# EAGLE design 9xVoice MikeB TH v1_0a (EAGLE 6.4)
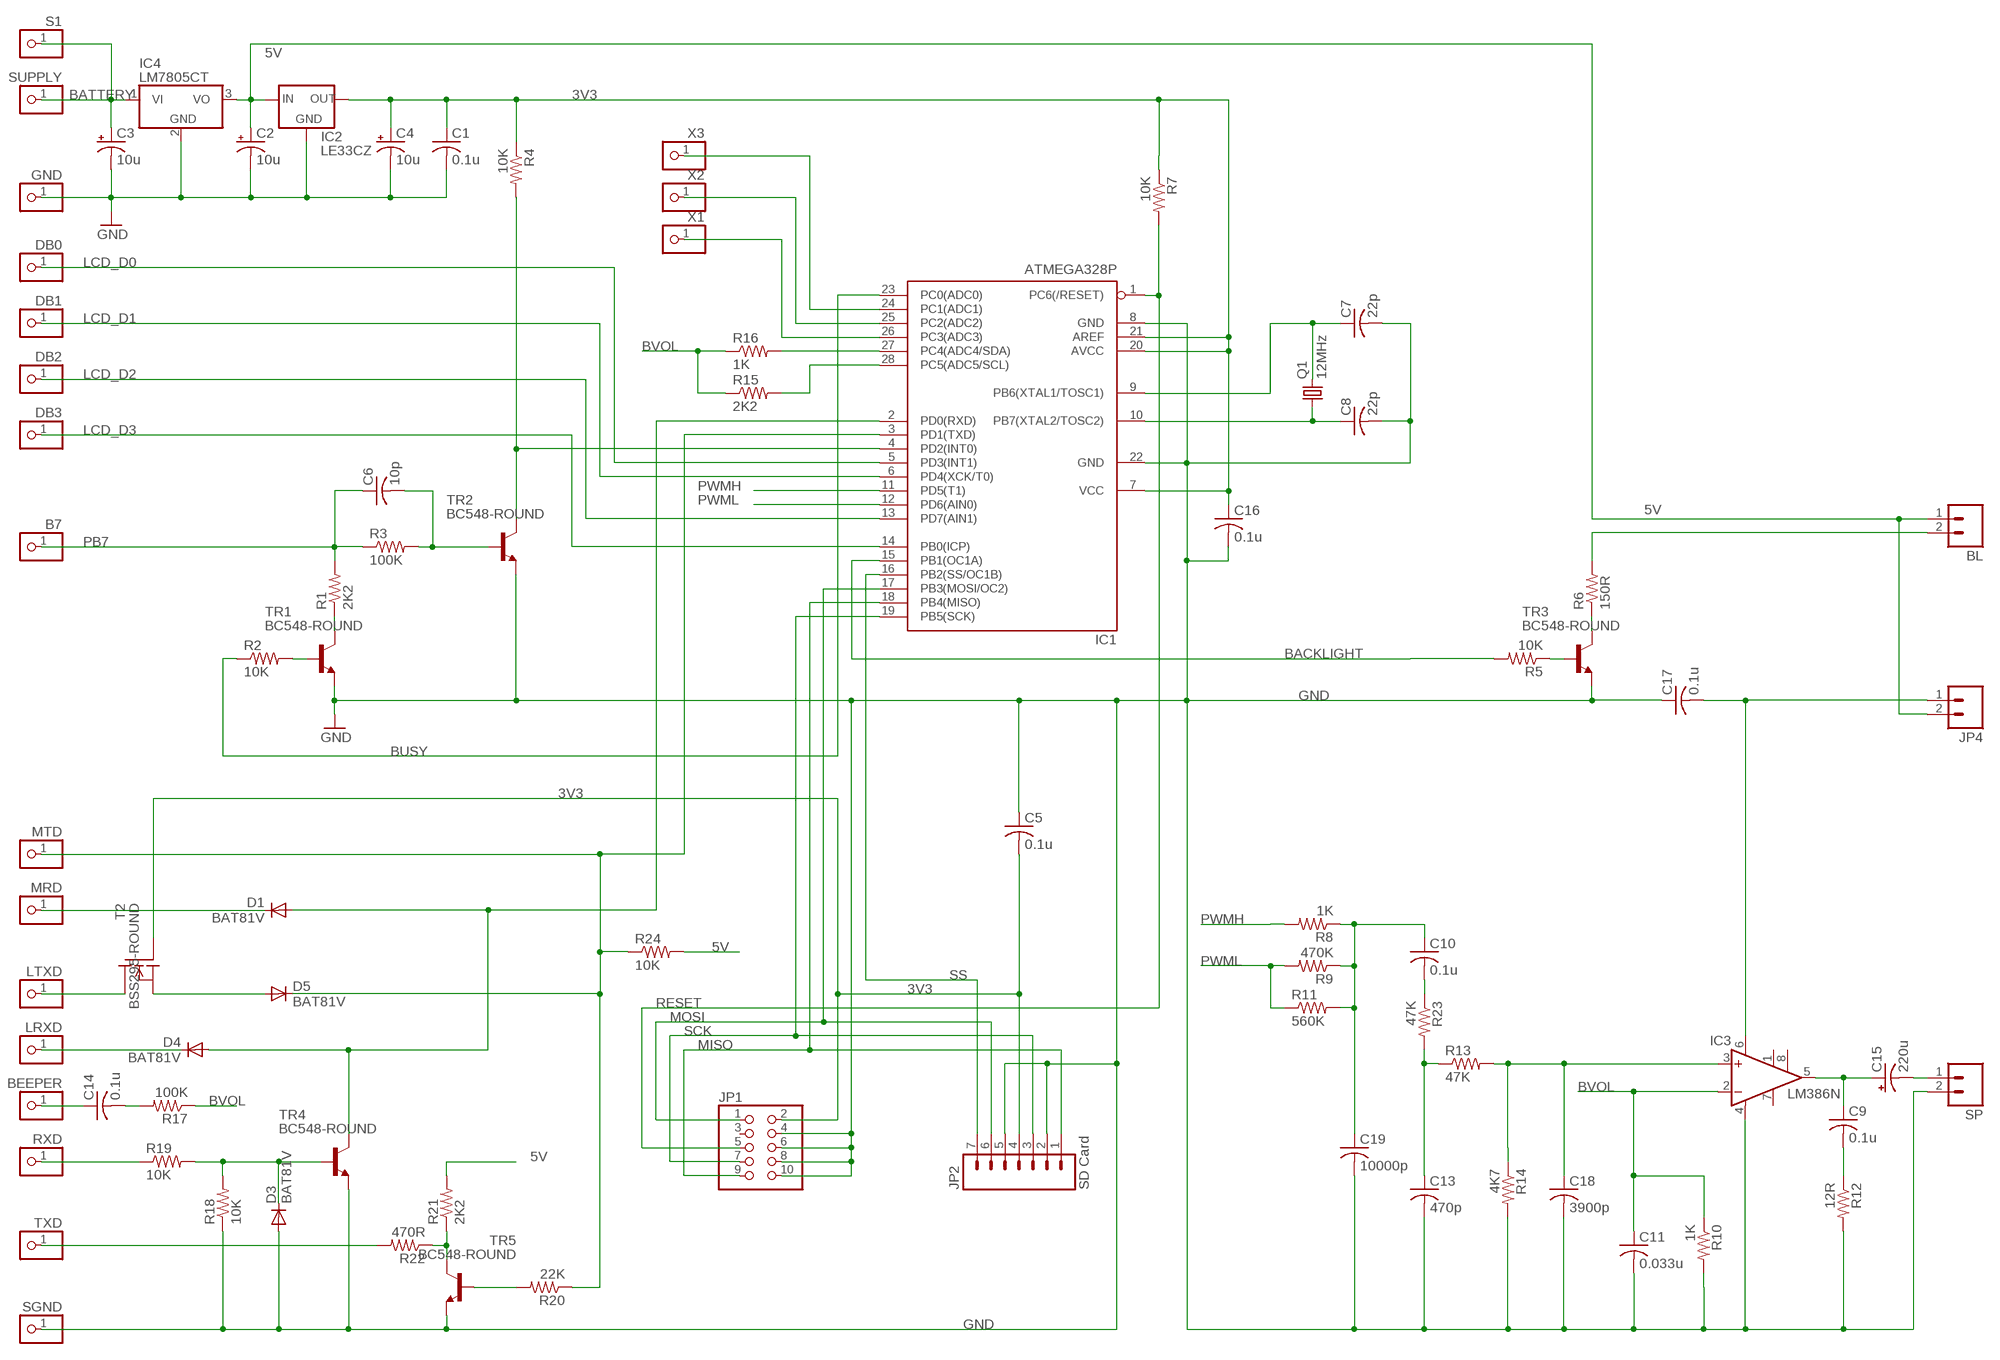
[diagram p0: schematic, sheet 1]

## Parts
B7  PINHD-1X1  [1X01]
BEEPER  PINHD-1X1  [1X01]
BL  M02PTH  [1X02]
C1  0.1u  C-US025-024X044  [C025-024X044]
C2  10u  CPOL-USE2.5-5  [E2,5-5]
C3  10u  CPOL-USE2.5-5  [E2,5-5]
C4  10u  CPOL-USE2.5-5  [E2,5-5]
C5  0.1u  C-US025-024X044  [C025-024X044]
C6  10p  C-US025-024X044  [C025-024X044]
C7  22p  C-US025-024X044  [C025-024X044]
C8  22p  C-US025-024X044  [C025-024X044]
C9  0.1u  C-US025-024X044  [C025-024X044]
C10  0.1u  C-US025-024X044  [C025-024X044]
C11  0.033u  C-US025-024X044  [C025-024X044]
C13  470p  C-US025-024X044  [C025-024X044]
C14  0.1u  C-US025-024X044  [C025-024X044]
C15  220u  CPOL-USE5-8.5  [E5-8,5]
C16  0.1u  C-US025-024X044  [C025-024X044]
C17  0.1u  C-US025-024X044  [C025-024X044]
C18  3900p  C-US025-024X044  [C025-024X044]
C19  10000p  C-US025-024X044  [C025-024X044]
D1  BAT81V  DIODE-D-2.5  [D-2.5]
D3  BAT81V  DIODE-D-2.5  [D-2.5]
D4  BAT81V  DIODE-D-2.5  [D-2.5]
D5  BAT81V  DIODE-D-2.5  [D-2.5]
DB0  PINHD-1X1  [1X01]
DB1  PINHD-1X1  [1X01]
DB2  PINHD-1X1  [1X01]
DB3  PINHD-1X1  [1X01]
GND  PINHD-1X1  [1X01]
IC1  ATMEGA328P  MEGA8-P-JDCJDC  [DIL28-3-JDC]
IC2  LE33CZ  78LXX-ROUND  [TO92-JDC]
IC3  LM386N  LM386N-1  [DIL08]
IC4  LM7805CT  7805T  [TO220H]
JP1  PINHD-2X5  [2X05]
JP2  SD Card  M07  [1X07]
JP4  M02PTH  [1X02]
LRXD  PINHD-1X1  [1X01]
LTXD  PINHD-1X1  [1X01]
MRD  PINHD-1X1  [1X01]
MTD  PINHD-1X1  [1X01]
Q1  12MHz  CRYSTALHC49US  [HC49US]
R1  2K2  R-US_0207/2V  [0207/2V]
R2  10K  R-US_0204/7  [0204/7]
R3  100K  R-US_0207/2V  [0207/2V]
R4  10K  R-US_0207/2V  [0207/2V]
R5  10K  R-US_0207/2V  [0207/2V]
R6  150R  R-US_0207/2V  [0207/2V]
R7  10K  R-US_0207/2V  [0207/2V]
R8  1K  R-US_0207/2V  [0207/2V]
R9  470K  R-US_0207/2V  [0207/2V]
R10  1K  R-US_0207/2V  [0207/2V]
R11  560K  R-US_0207/2V  [0207/2V]
R12  12R  R-US_0207/2V  [0207/2V]
R13  47K  R-US_0207/2V  [0207/2V]
R14  4K7  R-US_0207/2V  [0207/2V]
R15  2K2  R-US_0207/2V  [0207/2V]
R16  1K  R-US_0207/2V  [0207/2V]
R17  100K  R-US_0207/2V  [0207/2V]
R18  10K  R-US_0207/2V  [0207/2V]
R19  10K  R-US_0207/2V  [0207/2V]
R20  22K  R-US_0207/2V  [0207/2V]
R21  2K2  R-US_0207/2V  [0207/2V]
R22  470R  R-US_0207/2V  [0207/2V]
R23  47K  R-US_0207/2V  [0207/2V]
R24  10K  R-US_0207/2V  [0207/2V]
RXD  PINHD-1X1  [1X01]
S1  PINHD-1X1  [1X01]
SGND  PINHD-1X1  [1X01]
SP  M02PTH  [1X02]
SUPPLY  PINHD-1X1  [1X01]
T2  BSS295-ROUND  [TO92-JDC]
TR1  BC548-ROUND  [TO92-JDC]
TR2  BC548-ROUND  [TO92-JDC]
TR3  BC548-ROUND  [TO92-JDC]
TR4  BC548-ROUND  [TO92-JDC]
TR5  BC548-ROUND  [TO92-JDC]
TXD  PINHD-1X1  [1X01]
X1  PINHD-1X1  [1X01]
X2  PINHD-1X1  [1X01]
X3  PINHD-1X1  [1X01]

## Nets
3V3: C1.1 C4.+ C5.2 C16.1 IC1.7(VCC) IC1.20(AVCC) IC1.21(AREF) IC2.C(OUT) JP1.2 JP2.4 R4.1 R7.1 T2.B(G)
5V: BL.1 C2.+ IC2.E(IN) IC4.3(VO) JP4.2 R21.2 R24.2
BACKLIGHT: IC1.15(PB1(OC1A)) R5.2
BATTERY: C3.+ IC4.1(VI) S1.1 SUPPLY.1
BUSY: IC1.23(PC0(ADC0)) R2.1
BVOL: C11.1 IC3.2(-IN) R10.1 R15.1 R16.1 R17.1
GND: C1.2 C2.- C3.- C4.- C5.1 C7.2 C8.2 C11.2 C13.2 C16.2 C17.1 C18.2 C19.2 D3.A GND.1 IC1.8(GND) IC1.22(GND) IC2.B(GND) IC3.4(GND) IC4.2(GND) JP1.4 JP1.6 JP1.8 JP1.10 JP2.2 JP2.5 R10.2 R12.2 R14.2 R18.1 SGND.1 SP.2 TR1.E TR2.E TR3.E TR4.E TR5.E
LCD_D0: DB0.1 IC1.5(PD3(INT1))
LCD_D1: DB1.1 IC1.6(PD4(XCK/T0))
LCD_D2: DB2.1 IC1.13(PD7(AIN1))
LCD_D3: DB3.1 IC1.14(PB0(ICP))
MISO: IC1.18(PB4(MISO)) JP1.9 JP2.1
MOSI: IC1.17(PB3(MOSI/OC2)) JP1.1 JP2.6
N$1: C13.1 R13.1 R23.2
N$2: R21.1 R22.1 TR5.C
N$3: R22.2 TXD.1
N$4: R20.2 TR5.B
N$5: IC1.28(PC5(ADC5/SCL)) R15.2
N$6: IC1.27(PC4(ADC4/SDA)) R16.2
N$7: IC1.26(PC3(ADC3)) X1.1
N$8: IC1.25(PC2(ADC2)) X2.1
N$9: IC1.24(PC1(ADC1)) X3.1
N$10: R19.1 RXD.1
N$11: D3.C R18.2 R19.2 TR4.B
N$12: D4.C LRXD.1
N$14: D5.A T2.C(S)
N$17: LTXD.1 T2.E(D)
N$18: D1.C MRD.1
N$21: R1.1 TR1.C
N$22: R2.2 TR1.B
N$23: C6.2 R3.2 TR2.B
N$24: BEEPER.1 C14.1
N$25: C14.2 R17.2
N$26: R5.1 TR3.B
N$27: R6.1 TR3.C
N$28: C10.2 R23.1
N$29: IC1.4(PD2(INT0)) R4.2 TR2.C
N$30: C8.1 IC1.10(PB7(XTAL2/TOSC2)) Q1.1
N$31: C7.1 IC1.9(PB6(XTAL1/TOSC1)) Q1.2
N$33: BL.2 R6.2
N$34: C9.1 C15.+ IC3.5(OUT)
N$35: C9.2 R12.1
N$36: C15.- SP.1
N$37: C17.2 IC3.6(VS) JP4.1
N$39: C10.1 C19.1 R8.1 R9.1 R11.2
N$40: C18.1 IC3.3(+IN) R13.2 R14.1
PB7: B7.1 C6.1 R1.2 R3.1
PWMH: IC1.11(PD5(T1)) R8.2
PWML: IC1.12(PD6(AIN0)) R9.2 R11.1
RESET: IC1.1(PC6(/RESET)) JP1.5 R7.2
RXD: D1.A D4.A IC1.2(PD0(RXD)) TR4.C
SCK: IC1.19(PB5(SCK)) JP1.7 JP2.3
SS: IC1.16(PB2(SS/OC1B)) JP2.7
TXD: D5.C IC1.3(PD1(TXD)) MTD.1 R20.1 R24.1
Unconnected: IC3.1(GAIN) IC3.7(BYPASS) IC3.8(GAIN) JP1.3

## Library data of the parts
B7 BEEPER DB0 DB1-DB3 GND LRXD LTXD MRD MTD RXD S1 SGND SUPPLY TXD X1-X3 = pinhead:PINHD-1X1: PIN HEADER
BL JP4 SP = SparkFun-Connectors:M02: Header 2 Standard 2-pin 0.1" header. Use with straight break away headers (SKU : PRT-00116), right angle break away headers (PRT-00553), swiss pins (PRT-00743), machine pins (PRT-00117), and female headers (PRT-00115). Molex polarized connector foot print use with SKU : PRT-08233 with associated crimp pins and housings.
C1 C5-C11 C13 C14 C16-C19 = rcl:C-US: CAPACITOR, American symbol
C2-C4 C15 = rcl:CPOL-US: POLARIZED CAPACITOR, American symbol
D1 D3-D5 = diode:DIODE-: DIODE
IC1 = jdc:MEGA8-P-JDC: MICROCONTROLLER 8 Kbytes FLASH, 1 kbytes SRAM, 512 bytes EEPROM, USART, 4-channel 10 bit ADC, 2-channel 8 bit ADC Pin compatible with Atmega48, ATMega88, ATMega168 Source: avr.lbr
IC2 = jdc:78LXX: VOLTAGE REGULATOR
IC3 = linear:LM386?-*: Low Voltage Audio Power Amplifier Source: http://cache.national.com/ds/LM/LM386.pdf
IC4 = linear:78*: Positive VOLTAGE REGULATOR Source: http://cache.national.com/ds/LM/LM78L05.pdf http://www.fairchildsemi.com/ds/LM/LM7805.pdf
JP1 = pinhead:PINHD-2X5: PIN HEADER
JP2 = SparkFun-Connectors:M07: Header 7 Standard 7-pin 0.1" header. Use with straight break away headers (SKU : PRT-00116), right angle break away headers (PRT-00553), swiss pins (PRT-00743), machine pins (PRT-00117), and female headers (PRT-00115). NOTES ON THE VARIANTS LOCK and LOCK_LONGPADS... This footprint was designed to help hold the alignment of a through-hole component (i.e. 7-pin header) while soldering it into place. You may notice that each hole has been shifted either up or down by 0.005 of an inch from it's more standard position (which is usually a perfectly straight line). This slight alteration caused the pins (the squares in the middle) to touch the edges of the holes. Because they are alternating, it causes a "brace" to hold the header in place. 0.005 has proven to be the perfect amount of "off-center" position when using our standard breakaway headers. Although looks a little odd when you look at the bare footprint, once you have a header in there, the alteration is very hard to notice. Also, if you push a header all the way into place, it is covered up entirely on the bottom side. This idea of altering the position of holes to aid alignment will be further integrated into the Sparkfun Library for other footprints. It can help hold any component with 3 or more connection pins.
Q1 = SparkFun-FreqCtrl:CRYSTAL: Various standard crystals. Proven footprints. Spark Fun Electronics SKU : COM-00534
R1-R24 = rcl:R-US_: RESISTOR, American symbol
T2 = jdc:BSS295: N-Channel Enhancement MOSFET not checked
TR1-TR5 = jdc:BC548*: NPN Transistor

## Board
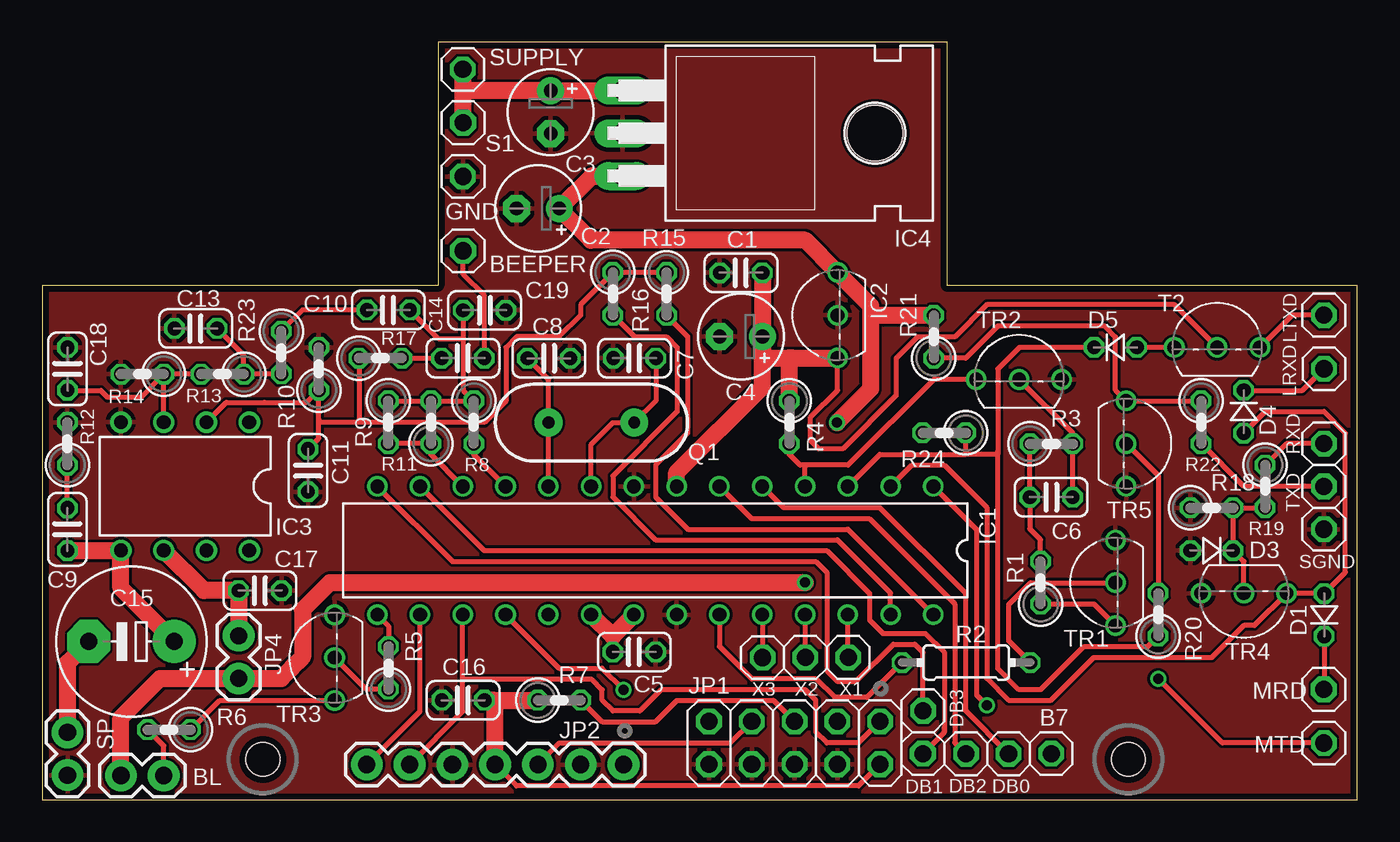
[diagram p1: board, top side]
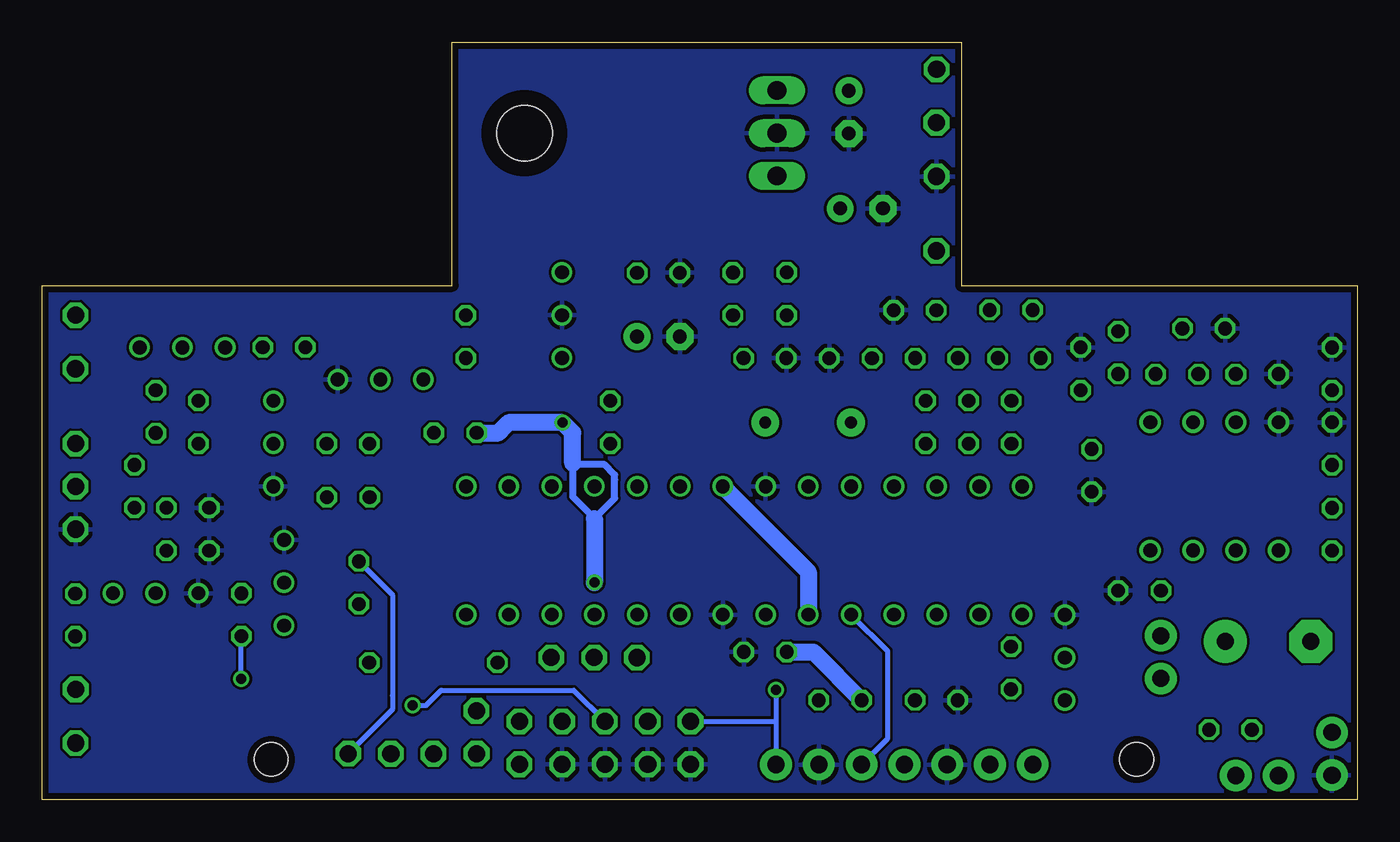
[diagram p2: board, bottom side, seen from below]

Size 78.1 x 45 mm. Coordinates in mm from the lower left corner, seen from the top.
Outline: 0,0 78.1,0 78.1,30.55 53.75,30.55 53.75,45 23.5,45 23.5,30.55 0,30.55 0,0
Copper layers (1*16): Top 0.0356mm / dielectric 1.5011mm / Bottom 0.0356mm
Design rules "LaenPCBOrder *": minimum track width 6mil, minimum drill 13mil, track to track 6mil, track to pad 6mil, pad to pad 6mil, via to via 6mil, smd to smd 6mil, copper to edge 15mil, drill to drill 6mil, minimum pad ring 7mil, minimum via ring 7mil, stop-mask expansion 4mil, vias tented up to drill 24mil, thermal gap 10mil
Holes 2 mm at 13.1,2.4 64.5,2.4

### Footprints (pad centres in the part's own frame; a part is rotated, then mirrored left to right if it is on the bottom)
1X01 = drill 1.016 octagon: 1 0,0
1X02 = drill 1.016 pad 1.88: 1 0,0; 2 2.54,0
C025-024X044 = drill 0.813 octagon: 1 -1.27,0; 2 1.27,0
E2,5-5 = drill 0.813 pad 1.6: + -1.27,0 | drill 0.813 pad 1.6 octagon: - 1.27,0
E5-8,5 = drill 1.016 pad 2.54: + -2.54,0 | drill 1.016 pad 2.54 octagon: - 2.54,0
D-2.5 = drill 0.813 octagon: A 1.27,0; C -1.27,0
DIL28-3-JDC = drill 0.813: 1 -16.51,-3.81; 2 -13.97,-3.81; 3 -11.43,-3.81; 4 -8.89,-3.81; 5 -6.35,-3.81; 6 -3.81,-3.81; 7 -1.27,-3.81; 8 1.27,-3.81; 9 3.81,-3.81; 10 6.35,-3.81; 11 8.89,-3.81; 12 11.43,-3.81; 13 13.97,-3.81; 14 16.51,-3.81; 15 16.51,3.81; 16 13.97,3.81; 17 11.43,3.81; 18 8.89,3.81; 19 6.35,3.81; 20 3.81,3.81; 21 1.27,3.81; 22 -1.27,3.81; 23 -3.81,3.81; 24 -6.35,3.81; 25 -8.89,3.81; 26 -11.43,3.81; 27 -13.97,3.81; 28 -16.51,3.81
TO92-JDC = drill 0.813: B 0,0; C -2.54,0; E 2.54,0
DIL08 = drill 0.813 pad 1.27: 1 -3.81,-3.81; 2 -1.27,-3.81; 3 1.27,-3.81; 4 3.81,-3.81; 5 3.81,3.81; 6 1.27,3.81; 7 -1.27,3.81; 8 -3.81,3.81
TO220H = drill 1.118 long: 1 -2.54,-10.16; 2 0,-10.16; 3 2.54,-10.16 | hole 3.302: 0,4.826
2X05 = drill 1.016 octagon: 1 -5.08,-1.27; 2 -5.08,1.27; 3 -2.54,-1.27; 4 -2.54,1.27; 5 0,-1.27; 6 0,1.27; 7 2.54,-1.27; 8 2.54,1.27; 9 5.08,-1.27; 10 5.08,1.27
1X07 = drill 1.016 pad 1.88: 1 0,0; 2 2.54,0; 3 5.08,0; 4 7.62,0; 5 10.16,0; 6 12.7,0; 7 15.24,0
HC49US = drill 0.7 pad 1.651: 1 -2.54,0; 2 2.54,0
0207/2V = drill 0.813 octagon: 1 -1.27,0; 2 1.27,0
0204/7 = drill 0.813 octagon: 1 -3.81,0; 2 3.81,0

### Placement (x,y rotation side)
B7  59.92,2.74 0 top
BEEPER  25,32.6 0 top
BL  4.68,1.44 0 top
C1  41.5,31.3 180 top
C2  29.44,35.12 180 top
C3  30.2,40.84 270 top
C4  41.5,27.51 180 top
C5  35.16,8.78 180 top
C6  59.92,17.97 0 top
C7  35.18,26.23 180 top
C8  30.09,26.22 0 top
C9  1.5,16.06 90 top
C10  20.56,29.09 180 top
C11  15.79,19.56 270 top
C13  9.12,27.99 180 top
C14  24.99,26.23 180 top
C15  5.31,9.4 180 top
C16  25,5.91 180 top
C17  12.94,12.42 180 top
C18  1.51,25.59 90 top
C19  26.27,29.07 0 top
D1  76.13,10.98 90 top
D3  69.45,14.8 180 top
D4  71.35,23.05 270 top
D5  63.73,26.87 0 top
DB0  57.39,2.73 0 top
DB1  54.86,2.73 0 top
DB2  52.3,2.74 0 top
DB3  52.31,5.28 0 top
GND  24.99,37.02 0 top
IC1  36.41,14.8 180 top
IC2  47.23,28.78 90 top
IC3  8.49,18.62 180 top
IC4  44.63,39.59 270 top
JP1  44.68,3.38 180 top
JP2  34.52,2.09 180 top
JP4  11.67,9.74 270 top
LRXD  76.12,25.6 0 top
LTXD  76.11,28.78 0 top
MRD  76.1,6.56 0 top
MTD  76.11,3.37 0 top
Q1  32.62,22.4 0 top
R1  59.29,12.89 90 top
R2  54.87,8.15 0 top
R3  59.93,21.14 0 top
R4  44.37,22.42 270 top
R5  20.57,7.83 90 top
R6  7.54,4.16 180 top
R7  30.71,5.91 0 top
R8  25.63,22.42 270 top
R9  20.55,22.42 270 top
R10  16.43,25.6 90 top
R11  23.09,22.42 90 top
R12  1.5,21.15 90 top
R13  10.71,25.28 180 top
R14  5.95,25.28 180 top
R15  37.08,30.04 270 top
R16  33.89,30.05 270 top
R17  20.08,26.23 0 top
R18  69.45,17.34 0 top
R19  72.62,18.61 270 top
R20  66.27,10.99 90 top
R21  52.94,27.5 90 top
R22  68.82,22.42 270 top
R23  14.2,26.56 270 top
R24  53.57,21.79 180 top
RXD  76.11,21.15 0 top
S1  25,40.21 0 top
SGND  76.11,16.07 0 top
SP  1.51,4 270 top
SUPPLY  24.98,43.38 0 top
T2  69.77,26.86 0 top
TR1  63.73,12.89 90 top
TR2  58.01,24.96 0 top
TR3  17.37,8.44 90 top
TR4  71.36,12.27 180 top
TR5  64.37,21.15 270 top
TXD  76.11,18.61 0 top
X1  47.87,8.45 0 top
X2  45.32,8.45 0 top
X3  42.78,8.44 0 top

### Tracks (layer width: path | path; a pad name or v marks a point on that pad's centre or on a via)
3V3
  Top 0.305: JP1.2 48.48,0.83 28.16,0.83 JP2.4 | T2.B 67.23,29.4 56.1,29.4 54.19,27.49 51.98,27.49 50.71,26.22 50.71,24 47.55,20.84 46.12,20.84 45.63,21.33 45.63,22.72 47.23,24.32 IC2.C
  Top 0.406: 33.89,9.7 C5.2
  Top 1.016: IC1.20 33.89,9.7 33.89,9.74 IC1.21 | C16.1 26.8,5.91 | 26.8,5.91 R7.1 | JP2.4 26.9,5.81 26.8,5.91 | C1.1 C4.+ 42.77,26.8 | 42.77,26.8 42.77,26.24 44.5,26.24 | 44.5,26.24 IC2.C | R4.1 44.37,26.24 44.5,26.24 | IC1.7 37.68,19.43 42.77,24.52 42.77,26.8
  Bottom 1.016: IC1.7 32.6,13.53 IC1.20 | C5.2 32.31,8.78 R7.1
5V  (via drill 0.6)
  Top 1.016: BL.1 4.68,4.88 7,7.2 JP4.2 14.2,7.2 14.8,7.8 15.47,8.47 15.47,11.28 17.09,12.9 v45.3,12.9 | 49.2,28.9 49.2,29.35 IC2.E 45.32,33.23 32.59,33.23 C2.+ 32.64,37.05 IC4.3 | 49.2,28.9 49.2,24.4 v47.2,22.4 | R21.2 49.33,28.77 49.2,28.9
  Bottom 0.305: 46.6,20 46.6,19.8 46.5,19.9 | 46.6,18.2 46.6,18
  Bottom 0.406: 46.5,19.9 44.7,19.9 44.1,19.3 44.1,19 44.1,17.9 45.3,16.7 46.6,18 46.6,19.8
  Bottom 1.016: R24.2 51.01,21.79 50.9,21.9 50.4,22.4 v47.2,22.4 46.6,21.8 46.6,20 | 45.3,16.7 v45.3,12.9
BACKLIGHT
  Top 0.305: IC1.15 20.57,10.32 R5.2
BATTERY
  Top 1.016: SUPPLY.1 24.98,42.1 | 24.98,42.1 24.98,40.23 S1.1 | IC4.1 34.44,42.1 C3.+ 24.98,42.1
BUSY
  Top 0.305: R2.1 48.98,6.07 47.07,6.07 45.96,7.18 42.14,7.18 40.22,9.1 IC1.23
BVOL
  Top 0.305: C11.1 16.43,21.47 16.43,22.6 | 16.43,22.6 R10.1 15.7,23.6 13.2,23.6 10.93,23.6 IC3.2 | R17.1 18.81,22.42 | 18.81,22.42 17.3,22.42 16.43,22.42 16.43,22.6 | R15.1 R16.1 31.98,29.41 31.98,28.77 30.71,27.5 28.17,27.5 27.54,26.87 27.54,23.69 26.27,22.42 18.81,22.42
GND
  pour Bottom: -1,-1 79.1,-1 79.1,46 -1,46
  pour Top: -2,-2 80,-2 80,47 -2,47
LCD_D0
  Top 0.305: DB0.1 54.84,5.28 54.84,12.26 49.76,17.34 44.04,17.34 IC1.5
LCD_D1
  Top 0.305: IC1.6 42.13,16.7 49.12,16.7 54.2,11.62 54.2,3.39 DB1.1
LCD_D2
  Top 0.305: IC1.13 26.25,14.8 46.6,14.8 49.13,12.27 49.13,10.67 49.92,9.88 52.46,9.88 53.57,8.77 53.57,4.3 | 53.57,4.3 53.57,4 | DB2.1 53.57,4.01 53.57,4.3
LCD_D3
  Top 0.305: IC1.14 24.36,14.15 45.95,14.15 46.59,13.51 46.59,7.66 47.23,7.02 48.33,7.02 50.55,9.24 51.82,9.24 52.31,8.75 DB3.1
MISO  (via drill 0.6)
  Top 0.305: IC1.18 30.7,7.81 33.26,7.81 v34.52,6.55 v34.52,6.54
  Bottom 0.305: v34.52,6.54 34.52,4.7 | 34.52,4.7 JP2.1 | JP1.9 34.52,4.65 34.52,4.7
MOSI
  Top 0.305: JP2.6 24.98,5.25 24.98,7.15 | 24.98,7.15 IC1.17 | JP1.1 48.48,3.37 46.59,3.37 45.95,4.01 45.95,5.91 45.32,6.54 36.75,6.54 35.49,5.28 33.89,5.28 33.25,5.92 33.25,6.54 32.64,7.15 24.98,7.15
N$1
  Top 0.305: C13.1 11.98,26.4 R13.1 R23.2
N$2
  Top 0.305: R22.1 TR5.C 63.74,24.32 63.74,27.49 63.09,28.14 56.75,28.14 54.84,26.23 R21.1
N$3
  Top 0.305: TXD.1 71.36,18.61 R22.2
N$4
  Top 0.305: TR5.B 66.27,19.25 R20.2
N$5
  Top 0.305: R15.2 38.33,27.52 38.33,21.78 36.43,19.88 36.43,17.98 38.35,16.06 47.8,16.06 | 47.8,16.06 47.84,16.06 | IC1.28 47.85,16.06 47.8,16.06
N$6
  Top 0.305: R16.2 35.17,27.5 37.07,27.5 37.7,26.87 37.7,23.05 33.89,19.24 33.89,17.98 36.43,15.44 47.22,15.44 50.38,12.28 IC1.27
N$7
  Top 0.305: X1.1 47.84,8.48 IC1.26
N$8
  Top 0.305: IC1.25 45.3,8.47 X2.1
N$9
  Top 0.305: IC1.24 42.76,8.46 X3.1
N$10
  Top 0.305: RXD.1 73.89,21.15 R19.1
N$11
  Top 0.305: TR4.B 71.36,14.16 D3.C R18.2 R19.2
N$12
  Top 0.305: D4.C 74.84,24.32 LRXD.1
N$14
  Top 0.305: T2.C D5.A
N$17
  Top 0.305: LTXD.1 74.23,28.78 T2.E
N$18
  Top 0.305: D1.C 76.13,6.59 MRD.1
N$21
  Top 0.305: R1.1 62.46,11.62 TR1.C
N$22
  Top 0.305: R2.2 57.4,9.43 57.4,11.6 58.69,12.89 TR1.B
N$23
  Top 0.305: TR2.B 61.2,21.77 R3.2 C6.2
N$24
  Top 0.305: C14.1 26.26,29.94 25,31.2 BEEPER.1
N$25
  Top 0.305: R17.2 C14.2
N$26
  Top 0.305: R5.1 19.25,6.56 TR3.B
N$27
  Top 0.305: R6.1 10.55,5.9 TR3.C
N$28
  Top 0.305: C10.2 15.46,29.09 R23.1
N$29
  Top 0.305: TR2.C 52.94,24.96 47.86,19.88 45.2,19.88 | 45.2,19.88 45.01,19.88 44.37,20.52 R4.2 | IC1.4 45.3,19.78 45.2,19.88
N$30
  Top 0.305: C8.1 30.08,24.96 Q1.1 30.06,22.38 IC1.10
N$31
  Top 0.305: C7.1 36.45,23.69 Q1.2 33.9,22.4 32.6,21.1 IC1.9
N$33
  Top 0.305: BL.2 7.22,3.21 R6.2
N$34
  Top 1.016: C15.+ 4.68,12.57 IC3.5 4.66,14.79 C9.1
N$35
  Top 0.305: C9.2 R12.1
N$36
  Top 1.016: SP.1 1.51,8.14 C15.-
N$37
  Top 1.016: IC3.6 9.61,12.42 C17.2 JP4.1
N$39
  Top 0.305: R9.1 R11.2 R8.1 25,24.32 25,27.4 | C19.1 25,27.4 | C10.1 23.52,27.4 25,27.4
N$40
  Top 0.305: R13.2 R14.1 | IC3.3 R14.1 | R14.1 5.84,23.9 4.7,23.9 3.91,23.9 3.49,24.32 C18.1
PB7
  Top 0.305: R3.1 C6.1 58.65,16.09 59.29,15.45 R1.2
  Bottom 0.305: R1.2 57.3,12.17 57.3,6.2 57.3,5.36 B7.1
PWMH
  Top 0.305: IC1.11 25.63,20.5 R8.2
PWML
  Top 0.305: IC1.12 23.09,20.5 R11.1 R9.2
RESET  (via drill 0.6)
  Top 0.305: R7.2 33.25,4.64 36.43,4.64 37.69,5.9 43.4,5.9 43.43,5.9 JP1.5 | IC1.1 55.48,16.05 55.48,6.22 v56.1,5.6
  Bottom 0.305: v56.1,5.6 55.3,5.6 54.4,6.5 46.53,6.5 JP1.5
RXD
  Top 0.305: D4.A 72.63,23.06 76.12,23.06 76.12,23.05 77.39,21.78 77.39,13.51 D1.A 76.11,12.27 TR4.C 71.98,10.35 71.35,10.35 69.45,8.45 62.45,8.45 59.91,5.91 57.39,5.91 56.1,7.2 56.1,17.35 53.57,19.88 51.65,19.88 IC1.2
SCK
  Top 0.305: JP2.3 30.72,3.37 39.76,3.37 40.86,3.37 JP1.7
  Bottom 0.305: IC1.19 27.9,8.83 27.9,5.6 27.9,3.63 JP2.3
SS
  Top 0.305: JP2.7 22.44,5.25 IC1.16
TXD  (via drill 0.6)
  Top 0.305: IC1.3 49.74,20.51 54.84,20.51 | 54.84,20.51 R24.1 | D5.C 58.03,26.87 56.75,25.59 56.75,20.7 | 56.75,20.7 56.75,20.51 54.84,20.51 | R20.1 65.63,9.08 61.83,9.08 59.29,6.54 58.01,6.54 56.75,7.8 56.75,20.7 | MTD.1 70.08,3.37 v66.27,7.18
  Bottom 0.305: v66.27,7.18 R20.1